# Altium schematic sheet ADC Module.SchDoc
size A; SheetNumber: 6; SheetTotal: 9
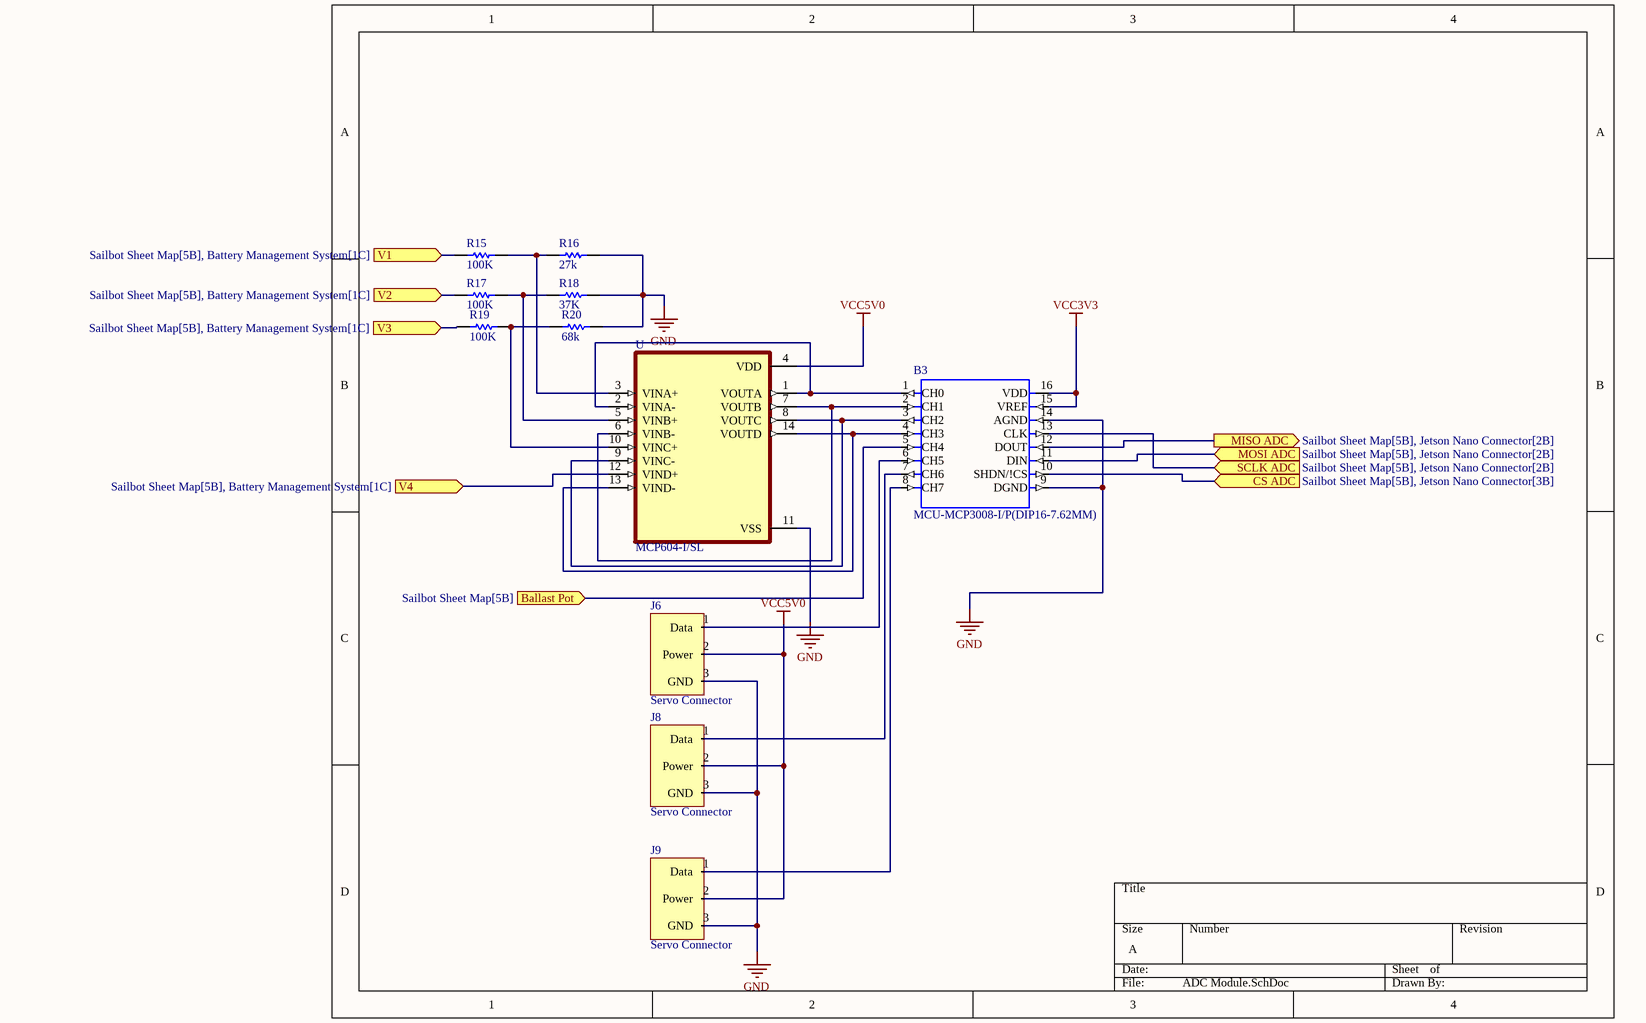
[diagram p0: ADC Module.SchDoc]

## Parts
B3  MCU-MCP3008-I/P(DIP16-7.62MM)  [DIP16-2.54-19.2X7.62MM]
J6  Servo Connector  [3 Pin 0.1in Header]
J8  Servo Connector  [3 Pin 0.1in Header]
J9  Servo Connector  [3 Pin 0.1in Header]
R15  value 100K  [6-0805_M]  (hidden comment: Resistor)
R16  value 27k  [6-0805_M]  (hidden comment: Resistor)
R17  value 100K  [6-0805_M]  (hidden comment: Resistor)
R18  value 37K  [6-0805_M]  (hidden comment: Resistor)
R19  value 100K  [6-0805_M]  (hidden comment: Resistor)
R20  value 68k  [6-0805_M]  (hidden comment: Resistor)
U  MCP604-I/SL  [SOIC127P600X175-14N]

## Ports
Ballast Pot (in, see Sailbot Sheet Map[5B]), CS ADC (in, see Sailbot Sheet Map[5B], Jetson Nano Connector[3B]), MISO ADC (out, see Sailbot Sheet Map[5B], Jetson Nano Connector[2B]), MOSI ADC (in, see Sailbot Sheet Map[5B], Jetson Nano Connector[2B]), SCLK ADC (in, see Sailbot Sheet Map[5B], Jetson Nano Connector[2B]), V1 (in, see Sailbot Sheet Map[5B], Battery Management System[1C]), V2 (in, see Sailbot Sheet Map[5B], Battery Management System[1C]), V3 (in, see Sailbot Sheet Map[5B], Battery Management System[1C]), V4 (in, see Sailbot Sheet Map[5B], Battery Management System[1C])

## Nets
GND: B3.9(DGND) B3.14(AGND) J6.3(GND) J8.3(GND) J9.3(GND) R16.1 R18.1 R20.2 U.11(VSS)
VCC3V3: B3.15(VREF) B3.16(VDD)
VCC5V0: J6.2(Power) J8.2(Power) J9.2(Power) U.4(VDD)
Ballast Pot: B3.5(CH4) ; port Ballast Pot
CS ADC: B3.10(SHDN/!CS) ; port CS ADC
MISO ADC: B3.12(DOUT) ; port MISO ADC
MOSI ADC: B3.11(DIN) ; port MOSI ADC
SCLK ADC: B3.13(CLK) ; port SCLK ADC
V1: R15.2 ; port V1
V2: R17.2 ; port V2
V3: R19.2 ; port V3
V4: U.12(VIND+) ; port V4
NetB3_1: B3.1(CH0) U.1(VOUTA) U.2(VINA-)
NetB3_2: B3.2(CH1) U.6(VINB-) U.7(VOUTB)
NetB3_3: B3.3(CH2) U.8(VOUTC) U.9(VINC-)
NetB3_4: B3.4(CH3) U.13(VIND-) U.14(VOUTD)
NetB3_6: B3.6(CH5) J6.1(Data)
NetB3_7: B3.7(CH6) J8.1(Data)
NetB3_8: B3.8(CH7) J9.1(Data)
NetR15_1: R15.1 R16.2 U.3(VINA+)
NetR17_1: R17.1 R18.2 U.5(VINB+)
NetR19_1: R19.1 R20.1 U.10(VINC+)

## Library data of the parts
B3 = MCU-MCP3008-I/P(DIP16-7.62MM): 10 Bit Analog to Digital Converter 4, 8 Input 1 SAR 16-PDIP; MF: Microchip; MP: MCP3008-I/P; Package: DIP-16 Microchip; SnapEDA_Link: https://www.snapeda.com/parts/MCP3008-I/P/Microchip/view-part/43628/?ref=snap; Availability: Unavailable; Price: None; Value: *
R15-R20 = Resistor: TC1: 0; SimulationGenericComponent: True; TC2: 0
U = MCP604-I/SL: General Purpose Amplifier 4 Circuit Rail-to-Rail 14-SOIC; MF: Microchip; Value: *; Package: SOIC-14 Microchip; MP: MCP604-I/SL; Price: None; SnapEDA_Link: https://www.snapeda.com/parts/MCP604-I/SL/Microchip/view-part/49119/?ref=snap; Availability: Unavailable